# EasyEDA schematic SCH_EDR Project_2023-04-19.json
TITLE: Soil moisture meter; REV: 1.0; Date: 2023-04-14; Sheet: 1/1; Drawn By: charith_dombawala; Company: University Of Moratuwa
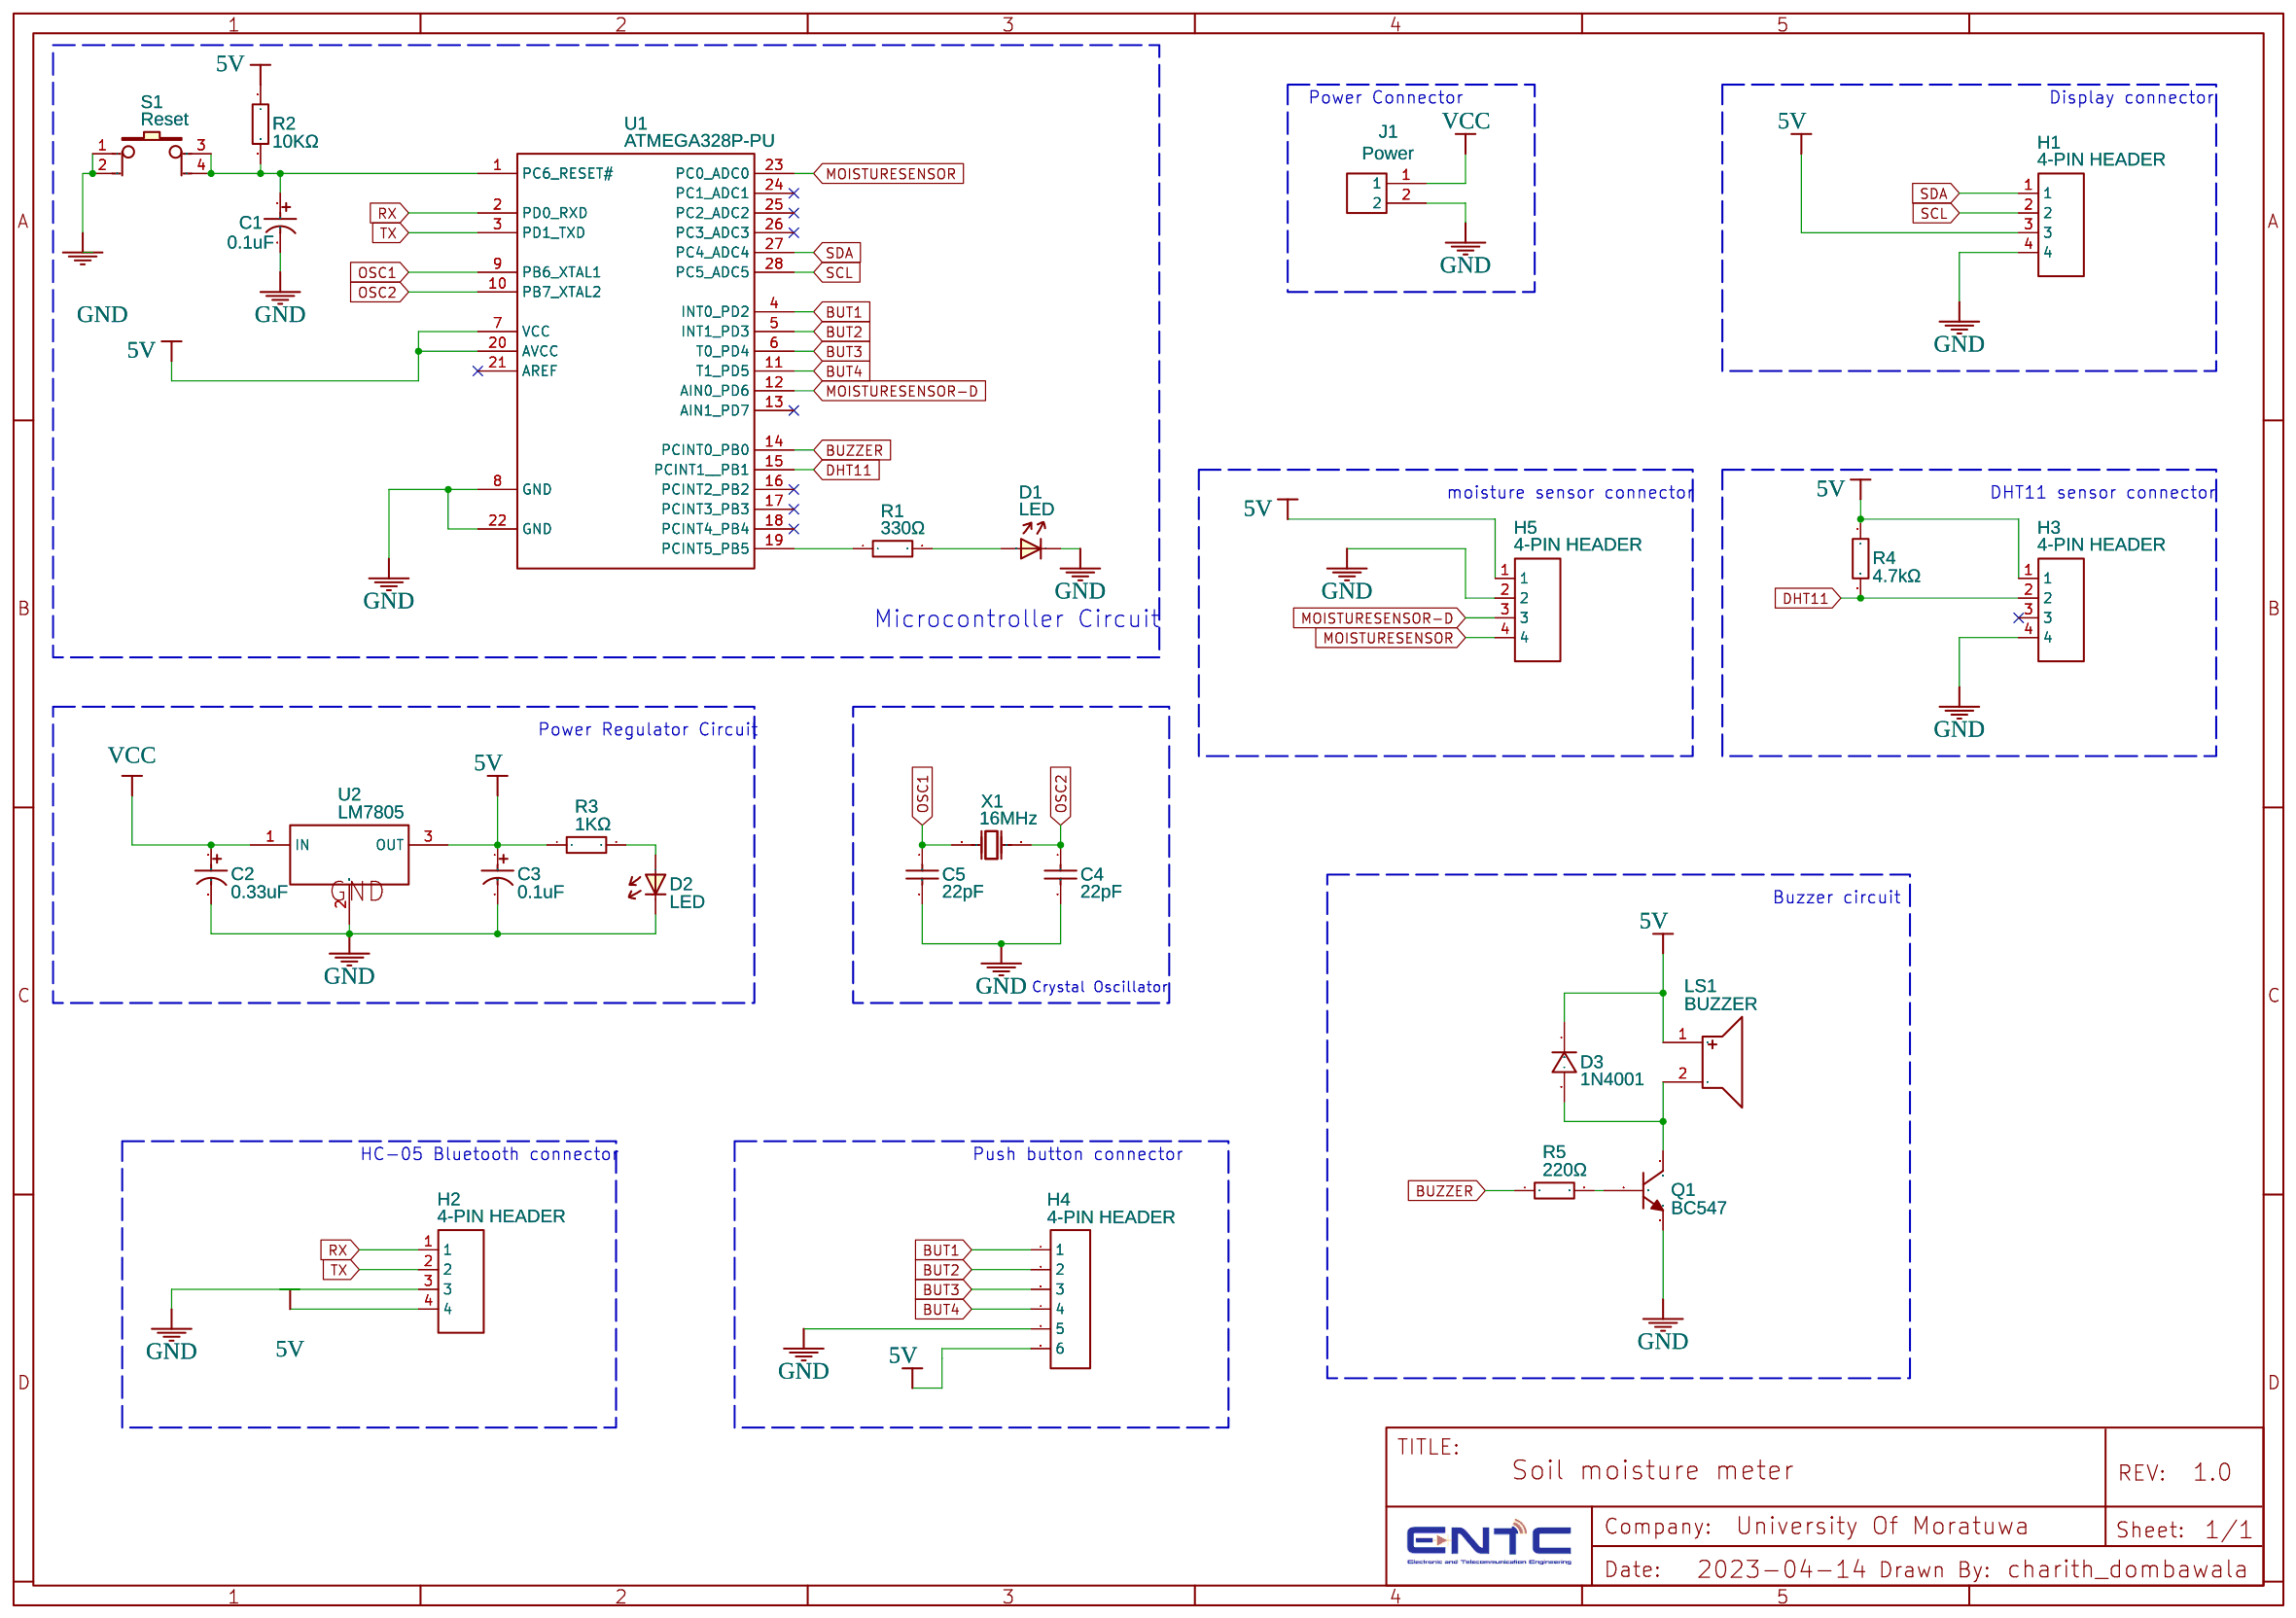
[diagram p0: schematic sheet]

## Parts
C1  0.1uF  [CAP-TH_BD5.0-P2.00-D0.8-FD]
C2  0.33uF  [CAP-TH_BD5.0-P2.00-D0.8-FD]
C3  0.1uF  [CAP-TH_BD5.0-P2.00-D0.8-FD]
C4  22pF  [CAP-TH_L3.5-W3.0-P2.54-D0.8]
C5  22pF  [CAP-TH_L3.5-W3.0-P2.54-D0.8]
D1  LED  [5MM LED]
D2  LED  [5MM LED]
D3  1N4001  [DO-41_BD2.4-L4.7-P8.70-D0.9-RD]
H1  4-PIN HEADER  [HEADER - HEADER-FEMALE-2.54_1X4]
H2  4-PIN HEADER  [HEADER - HEADER-FEMALE-2.54_1X4]
H3  4-PIN HEADER  [HEADER - HEADER-FEMALE-2.54_1X4]
H4  4-PIN HEADER  [HDR-F-2.54_1X6]
H5  4-PIN HEADER  [HEADER - HEADER-FEMALE-2.54_1X4]
J1  Power  [CONN-TH_XHB-2A]
LS1  BUZZER  [DIP-BUZZER-12X6]
Q1  BC547  [TO-92-3_L4.9-W3.7-P2.54-L]
R1  330Ω  [AXIAL-0.4]
R2  10KΩ  [AXIAL-0.4]
R3  1KΩ  [AXIAL-0.4]
R4  4.7kΩ  [AXIAL-0.4]
R5  220Ω  [AXIAL-0.4]
S1  Reset  [KEY-TH_4P-L6.0-W6.0-P4.50]
U1  ATMEGA328P-PU  [DIP-28_L34.6-W7.3-P2.54-LS10.2-BL]
U2  LM7805  [TO-220-3_L10.0-W4.5-P2.54-L]
X1  16MHz  [CRYSTAL-TH_L10.8-W4.5-P4.88]

## Library data of the parts
C1 C3 = 0.1uF: Supplier: LCSC; Manufacturer: ValuePro; Manufacturer Part: 0.1UF 50V; Supplier Part: C28061; JLCPCB Part Class: Extended Part
C2 = 0.33uF: Supplier: LCSC; Manufacturer: ValuePro; Manufacturer Part: 0.33uF 50V 5*11; Supplier Part: C45097; JLCPCB Part Class: Extended Part
C4 C5 = 22pf/50V 10%: Supplier: LCSC; Manufacturer: ReliaPro; Supplier Part: C9316; JLCPCB Part Class: Extended Part
D1 D2 = LED: Manufacturer Part: 5mm LED; Contributor: Axbri
D3 = 1N4001: Supplier: LCSC; Supplier Part: C99656; Manufacturer: Diodes Incorporated; Contributor: LCSC; JLCPCB Part Class: Extended Part
H1-H3 H5 = HEADER - HEADER-FEMALE-2.54_1X4: Contributor: Kang Yi Te; Supplier: Sparkfun
H4 = HDR-F-2.54_1x6: Supplier Part: C40877; Supplier: LCSC; Contributor: LCEDA_Lib
J1 = JST_2 PIN: Supplier: LCSC; Manufacturer: BOOMELE; Manufacturer Part: XHB-2A Connector; image: //image.lceda.cn/szlcsc/C57981.jpg; Supplier Part: C57981; JLCPCB Part Class: Extended Part
LS1 = BUZZER: Supplier: LCSC; Manufacturer: HNDZ; Manufacturer Part: BUZZERHMB1206-03; Contributor: วริศรา เกรียงไกรวัฒน์ /ทิพพะ; Supplier Part: C96101
Q1 = BC547BTF: Supplier: LCSC; Supplier Part: C900798; Manufacturer: onsemi(安森美); Contributor: LCSC; JLCPCB Part Class: Extended Part
R1-R5 = RESISTOR: Power: 1/4W; Tolerance: ±1%; EasyEDA: E57439; Supplier Part: E57439; Supplier: LCSC; Manufacturer: UniOhm; Manufacturer Part: MFR0W4F2200A50
S1 = Push_Button: Supplier Part: C59980; Supplier: LCSC; Manufacturer: ReliaPro; Manufacturer Part: button6*6*8.5; image: http://image.lceda.cn/szlcsc/C59980.jpg
U1 = ATMEGA328P-PU: sourceId: Oic6oiASL; Supplier: LCSC; Manufacturer: MICROCHIP(美国微芯); Contributor: LCSC; Supplier Part: C33901; JLCPCB Part Class: Extended Part
U2 = 7805(TO-220): Supplier: LCSC; Manufacturer: STMicroelectronics; Manufacturer Part: L7805CV-DG; Supplier Part: C3795; Contributor: LCEDA_Lib
X1 = ATS16A: Supplier: LCSC; Supplier Part: C1669847; Manufacturer: CTS(西迪斯); link: https://atta.szlcsc.com/upload/public/pdf/source/20200318/C487700_6E42144C1E843ECF848E205586EC895F.pdf; Contributor: lcsc

## Nets
5V: C3.1 D3.1(C) H1.3 H2.4 H3.1 H4.6 H5.1 LS1.1 R2.1 R3.1 R4.1 U1.7(VCC) U1.20(AVCC) U2.3(OUT)
GND: C1.2 C2.2 C3.2 C4.2 C5.2 D1.2 D2.2 H1.4 H2.3 H3.4 H4.5 H5.2 J1.2 Q1.3(E) S1.1 S1.2 U1.8(GND) U1.22(GND) U2.2(GND)
VCC: C2.1 J1.1 U2.1(IN)
BUT1: H4.1 U1.4(INT0 PD2)
BUT2: H4.2 U1.5(INT1 PD3)
BUT3: H4.3 U1.6(T0 PD4)
BUT4: H4.4 U1.11(T1 PD5)
BUZZER: R5.1 U1.14(PCINT0 PB0)
DHT11: H3.2 R4.2 U1.15(PCINT1  PB1)
MOISTURESENSOR: H5.4 U1.23(PC0 ADC0)
MOISTURESENSOR-D: H5.3 U1.12(AIN0 PD6)
OSC1: C5.1 U1.9(PB6 XTAL1) X1.1
OSC2: C4.1 U1.10(PB7 XTAL2) X1.2
RX: H2.1 U1.2(PD0 RXD)
SCL: H1.2 U1.28(PC5 ADC5)
SDA: H1.1 U1.27(PC4 ADC4)
TX: H2.2 U1.3(PD1 TXD)
Net-(C1-1): C1.1 R2.2 S1.3 S1.4 U1.1(PC6 RESET#)
Net-(D1-1): D1.1 R1.2
Net-(D2-1): D2.1 R3.2
Net-(D3-2): D3.2(A) LS1.2 Q1.1(C)
Net-(Q1-2): Q1.2(B) R5.2
Net-(R1-1): R1.1 U1.19(PCINT5 PB5)

Not connected (* = marked no-connect by the designer): H3 3*; U1 13(AIN1 PD7)* 16(PCINT2 PB2)* 17(PCINT3 PB3)* 18(PCINT4 PB4)* 21(AREF)* 24(PC1 ADC1)* 25(PC2 ADC2)* 26(PC3 ADC3)*

## Notes on the sheet
- Power Connector
- Display connector
- moisture sensor connector
- DHT11 sensor connector
- Microcontroller Circuit
- Power Regulator Circuit
- Buzzer circuit
- Crystal Oscillator
- HC-05 Bluetooth connector
- Push button connector
